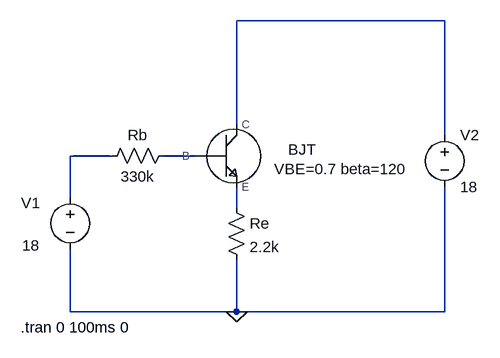
[diagram p0: schematic Ex4.asc]
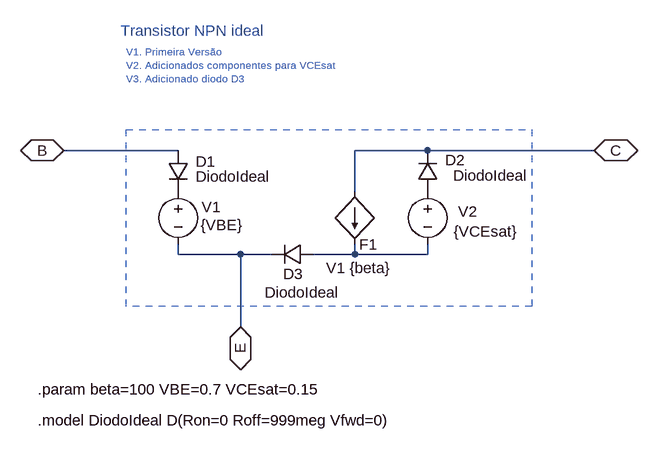
[diagram p1: sub-circuit bjt_npn_ideal.asc]
Ex4.asc, the LTspice schematic file:
Version 4
SHEET 1 880 680
WIRE 528 -64 208 -64
WIRE 208 96 208 -64
WIRE 528 112 528 -64
WIRE 16 144 -48 144
WIRE 144 144 96 144
WIRE -48 208 -48 144
WIRE 208 224 208 192
WIRE -48 384 -48 288
WIRE 208 384 208 304
WIRE 208 384 -48 384
WIRE 528 384 528 192
WIRE 528 384 208 384
FLAG 208 384 0
SYMBOL BJT_NPN_ideal 256 144 R0
WINDOW 0 53 6 Bottom 2
WINDOW 39 112 36 Bottom 2
SYMATTR InstName BJT
SYMATTR SpiceLine VBE=0.7 beta=120
SYMBOL res 192 208 R0
SYMATTR InstName Re
SYMATTR Value 2.2k
SYMBOL res 112 128 R90
WINDOW 0 0 56 VBottom 2
WINDOW 3 32 56 VTop 2
SYMATTR InstName Rb
SYMATTR Value 330k
SYMBOL voltage -48 192 R0
WINDOW 0 -75 25 Left 2
WINDOW 3 -74 90 Left 2
WINDOW 123 0 0 Left 0
WINDOW 39 0 0 Left 0
SYMATTR InstName V1
SYMATTR Value 18
SYMBOL voltage 528 96 R0
WINDOW 123 0 0 Left 0
WINDOW 39 0 0 Left 0
SYMATTR InstName V2
SYMATTR Value 18
TEXT -124 408 Left 2 !.tran 0 100ms 0

bjt_npn_ideal.asc, the sub-circuit schematic file:
Version 4
SHEET 1 1136 728
WIRE 176 -448 0 -448
WIRE 560 -448 448 -448
WIRE 816 -448 560 -448
WIRE 448 -384 448 -448
WIRE 176 -288 176 -304
WIRE 272 -288 176 -288
WIRE 320 -288 272 -288
WIRE 448 -288 448 -304
WIRE 448 -288 384 -288
WIRE 560 -288 560 -304
WIRE 560 -288 448 -288
WIRE 272 -176 272 -288
FLAG 0 -448 B
IOPIN 0 -448 BiDir
FLAG 272 -176 E
IOPIN 272 -176 BiDir
FLAG 816 -448 C
IOPIN 816 -448 BiDir
SYMBOL voltage 176 -400 R0
WINDOW 123 0 0 Left 0
WINDOW 39 0 0 Left 0
WINDOW 3 35 67 Left 2
WINDOW 0 36 39 Left 2
SYMATTR Value {VBE}
SYMATTR InstName V1
SYMBOL f 448 -384 R0
WINDOW 3 -44 117 Left 2
WINDOW 0 7 81 Left 2
SYMATTR Value V1 {beta}
SYMATTR InstName F1
SYMBOL diode 160 -448 R0
WINDOW 0 43 17 Left 2
WINDOW 3 43 40 Left 2
SYMATTR InstName D1
SYMATTR Value DiodoIdeal
SYMBOL voltage 560 -400 R0
WINDOW 123 0 0 Left 0
WINDOW 39 0 0 Left 0
WINDOW 3 40 77 Left 2
WINDOW 0 47 46 Left 2
SYMATTR Value {VCEsat}
SYMATTR InstName V2
SYMBOL diode 576 -384 R180
WINDOW 0 -42 49 Left 2
WINDOW 3 -139 25 Left 2
SYMATTR InstName D2
SYMATTR Value DiodoIdeal
SYMBOL diode 384 -304 R90
WINDOW 0 62 31 VBottom 2
WINDOW 3 59 17 VTop 2
SYMATTR InstName D3
SYMATTR Value DiodoIdeal
TEXT -40 -80 Left 2 !.param beta=100 VBE=0.7 VCEsat=0.15
TEXT -40 -32 Left 2 !.model DiodoIdeal D(Ron=0 Roff=999meg Vfwd=0)
TEXT 88 -632 Left 2 ;Transistor NPN ideal
TEXT 96 -600 Left 1 ;V1. Primeira Versão\nV2. Adicionados componentes para VCEsat\nV3. Adicionado diodo D3
RECTANGLE Normal 720 -208 96 -480 2

The netlist it stands for:
* Ex4.asc
XBJT N001 N003 N004 bjt_npn_ideal params: VBE=0.7 beta=120
Re N004 0 2.2k
Rb N003 N002 330k
V1 N002 0 18
V2 N001 0 18

* block symbol definitions
.subckt bjt_npn_ideal C B E
V1 P001 E {VBE}
F1 C N001 V1 {beta}
D1 B P001 DiodoIdeal
V2 P002 N001 {VCEsat}
D2 P002 C DiodoIdeal
D3 N001 E DiodoIdeal
.param beta=100 VBE=0.7 VCEsat=0.15
.model DiodoIdeal D(Ron=0 Roff=999meg Vfwd=0)
* Transistor NPN ideal
* V1. Primeira Versão
* V2. Adicionados componentes para VCEsat
* V3. Adicionado diodo D3
.ends bjt_npn_ideal

.model D D
.lib standard.dio
.tran 0 100ms 0
.backanno
.end